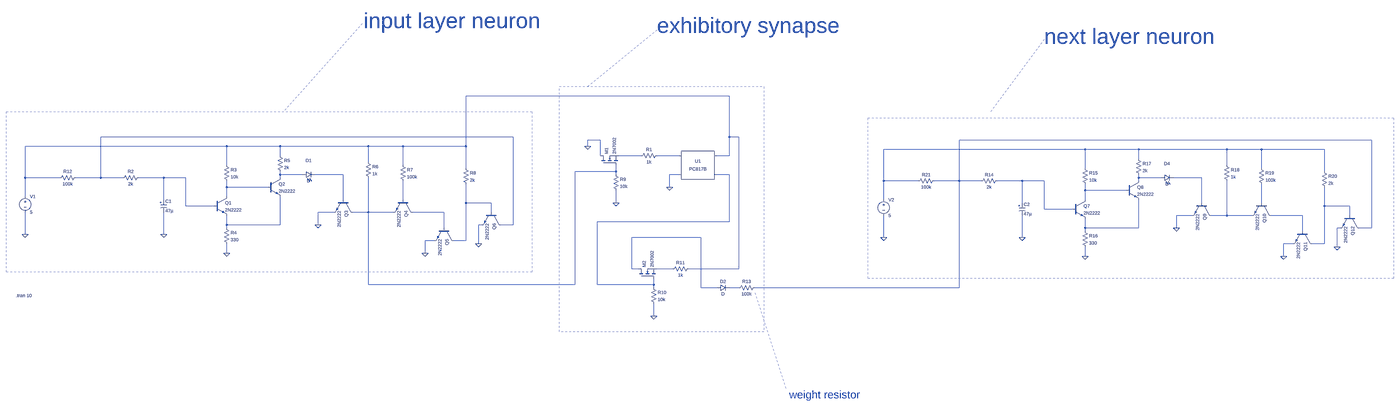
[diagram p0: schematic good_synapse_exhibitory.asc, whole sheet]
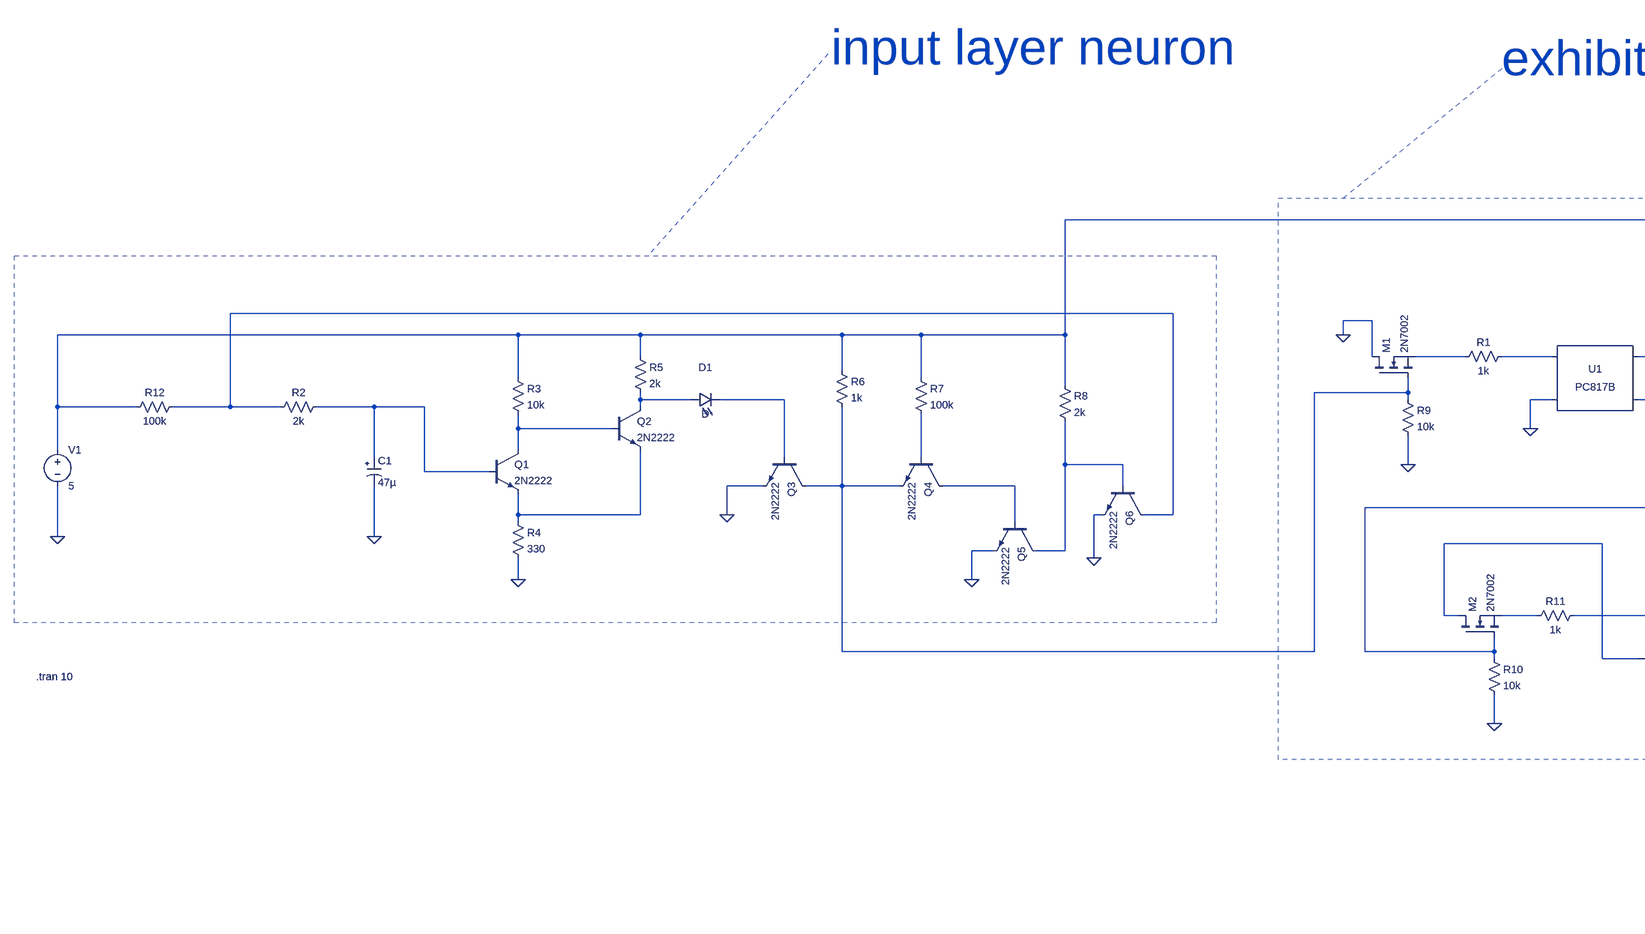
[diagram p1: schematic good_synapse_exhibitory.asc, part, row 1 of 1, column 1 of 2]
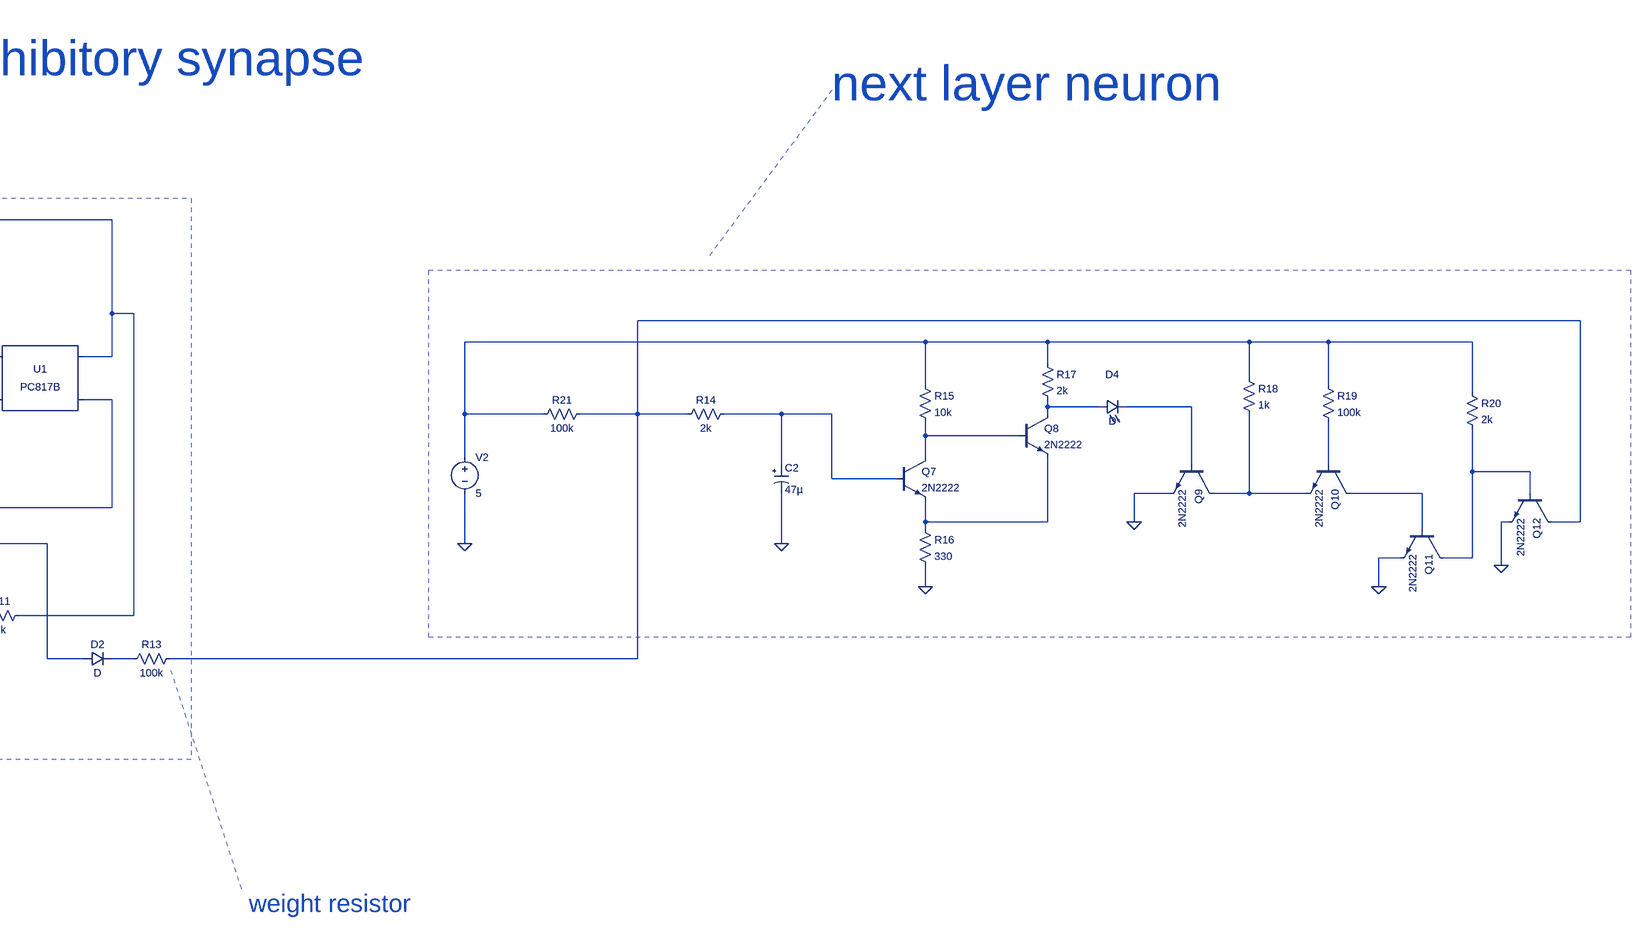
[diagram p2: schematic good_synapse_exhibitory.asc, part, row 1 of 1, column 2 of 2]
good_synapse_exhibitory.asc, the LTspice schematic file:
Version 4.1
SHEET 1 11668 9364
WIRE 3504 -400 2064 -400
WIRE 2304 -192 208 -192
WIRE 3504 -192 3504 -400
WIRE 3552 -192 3504 -192
WIRE 2848 -176 2784 -176
WIRE 6768 -176 4672 -176
WIRE 848 -144 -176 -144
WIRE 1120 -144 848 -144
WIRE 1568 -144 1120 -144
WIRE 1744 -144 1568 -144
WIRE 2064 -144 2064 -400
WIRE 2064 -144 1744 -144
WIRE 2784 -144 2784 -176
WIRE 5312 -128 4288 -128
WIRE 5584 -128 5312 -128
WIRE 6032 -128 5584 -128
WIRE 6208 -128 6032 -128
WIRE 6528 -128 6208 -128
WIRE 1120 -96 1120 -144
WIRE 2848 -96 2848 -176
WIRE 3056 -96 2944 -96
WIRE 3248 -96 3136 -96
WIRE 3504 -96 3504 -192
WIRE 3504 -96 3440 -96
WIRE 5584 -80 5584 -128
WIRE 1568 -64 1568 -144
WIRE 848 -48 848 -144
WIRE 1744 -48 1744 -144
WIRE 6032 -48 6032 -128
WIRE 2064 -32 2064 -144
WIRE 5312 -32 5312 -128
WIRE 6208 -32 6208 -128
WIRE 2928 -16 2928 -48
WIRE 2928 -16 2720 -16
WIRE 6528 -16 6528 -128
WIRE 1120 0 1120 -16
WIRE 1232 0 1120 0
WIRE 1440 0 1296 0
WIRE 2928 0 2928 -16
WIRE 3248 0 3200 0
WIRE 3504 0 3440 0
WIRE -176 16 -176 -144
WIRE 0 16 -176 16
WIRE 208 16 208 -192
WIRE 208 16 80 16
WIRE 320 16 208 16
WIRE 528 16 400 16
WIRE 640 16 528 16
WIRE 1120 16 1120 0
WIRE 5584 16 5584 0
WIRE 5696 16 5584 16
WIRE 5904 16 5760 16
WIRE 4288 32 4288 -128
WIRE 4464 32 4288 32
WIRE 4672 32 4672 -176
WIRE 4672 32 4544 32
WIRE 4784 32 4672 32
WIRE 4992 32 4864 32
WIRE 5104 32 4992 32
WIRE 5584 32 5584 16
WIRE 848 64 848 32
WIRE 1056 64 848 64
WIRE 3200 64 3200 0
WIRE 5312 80 5312 48
WIRE 5520 80 5312 80
WIRE -176 112 -176 16
WIRE 848 112 848 64
WIRE 528 128 528 16
WIRE 1440 128 1440 0
WIRE 1744 128 1744 32
WIRE 4288 128 4288 32
WIRE 5312 128 5312 80
WIRE 2064 144 2064 48
WIRE 2192 144 2064 144
WIRE 2928 144 2928 80
WIRE 4992 144 4992 32
WIRE 5904 144 5904 16
WIRE 6208 144 6208 48
WIRE 640 160 640 16
WIRE 784 160 640 160
WIRE 6528 160 6528 64
WIRE 6656 160 6528 160
WIRE 5104 176 5104 32
WIRE 5248 176 5104 176
WIRE 1392 192 1312 192
WIRE 1568 192 1568 16
WIRE 1568 192 1488 192
WIRE 1696 192 1568 192
WIRE 1952 192 1792 192
WIRE 2192 192 2192 144
WIRE 5856 208 5776 208
WIRE 6032 208 6032 32
WIRE 6032 208 5952 208
WIRE 6160 208 6032 208
WIRE 6416 208 6256 208
WIRE 6656 208 6656 160
WIRE 3504 240 3504 0
WIRE 3504 240 2832 240
WIRE 848 256 848 208
WIRE 1120 256 1120 112
WIRE 1120 256 848 256
WIRE 1312 256 1312 192
WIRE 2144 256 2128 256
WIRE 2304 256 2304 -192
WIRE 2304 256 2240 256
WIRE 848 272 848 256
WIRE 1952 272 1952 192
WIRE 5312 272 5312 224
WIRE 5584 272 5584 128
WIRE 5584 272 5312 272
WIRE 5776 272 5776 208
WIRE 6608 272 6592 272
WIRE 6768 272 6768 -176
WIRE 6768 272 6704 272
WIRE 5312 288 5312 272
WIRE 6416 288 6416 208
WIRE -176 304 -176 192
WIRE 528 304 528 192
WIRE 3360 320 3008 320
WIRE 4288 320 4288 208
WIRE 4992 320 4992 208
WIRE 1904 336 1856 336
WIRE 2064 336 2064 144
WIRE 2064 336 2000 336
WIRE 2128 352 2128 256
WIRE 6368 352 6320 352
WIRE 6528 352 6528 160
WIRE 6528 352 6464 352
WIRE 6592 368 6592 272
WIRE 848 400 848 352
WIRE 1856 400 1856 336
WIRE 5312 416 5312 368
WIRE 6320 416 6320 352
WIRE 3008 480 3008 320
WIRE 3040 480 3008 480
WIRE 3216 480 3136 480
WIRE 3552 480 3552 -192
WIRE 3552 480 3296 480
WIRE 1568 560 1568 192
WIRE 2720 560 2720 -16
WIRE 2720 560 1568 560
WIRE 2832 560 2832 240
WIRE 3120 560 3120 528
WIRE 3120 560 2832 560
WIRE 3120 576 3120 560
WIRE 3360 576 3360 320
WIRE 3440 576 3360 576
WIRE 3552 576 3504 576
WIRE 4672 576 4672 32
WIRE 4672 576 3632 576
WIRE 3120 720 3120 656
FLAG -176 304 0
FLAG 528 304 0
FLAG 848 400 0
FLAG 1312 256 0
FLAG 1856 400 0
FLAG 2128 352 0
FLAG 2784 -144 0
FLAG 2928 144 0
FLAG 3200 64 0
FLAG 3120 720 0
FLAG 4288 320 0
FLAG 4992 320 0
FLAG 5312 416 0
FLAG 5776 272 0
FLAG 6320 416 0
FLAG 6592 368 0
SYMBOL res 416 0 R90
WINDOW 0 0 56 VBottom 2
WINDOW 3 32 56 VTop 2
SYMATTR InstName R2
SYMATTR Value 2k
SYMBOL polcap 512 128 R0
SYMATTR InstName C1
SYMATTR Value 47µ
SYMBOL npn 784 112 R0
SYMATTR InstName Q1
SYMATTR Value 2N2222
SYMBOL res 832 -64 R0
SYMATTR InstName R3
SYMATTR Value 10k
SYMBOL res 832 256 R0
SYMATTR InstName R4
SYMATTR Value 330
SYMBOL npn 1056 16 R0
SYMATTR InstName Q2
SYMATTR Value 2N2222
SYMBOL res 1104 -112 R0
SYMATTR InstName R5
SYMATTR Value 2k
SYMBOL LED 1232 16 R270
WINDOW 0 72 32 VTop 2
WINDOW 3 0 32 VBottom 2
SYMATTR InstName D1
SYMBOL npn 1488 128 R90
SYMATTR InstName Q3
SYMATTR Value 2N2222
SYMBOL res 1552 -80 R0
SYMATTR InstName R6
SYMATTR Value 1k
SYMBOL npn 1792 128 R90
SYMATTR InstName Q4
SYMATTR Value 2N2222
SYMBOL res 1728 -64 R0
SYMATTR InstName R7
SYMATTR Value 100k
SYMBOL npn 2000 272 R90
SYMATTR InstName Q5
SYMATTR Value 2N2222
SYMBOL res 2048 -48 R0
SYMATTR InstName R8
SYMATTR Value 2k
SYMBOL npn 2240 192 R90
SYMATTR InstName Q6
SYMATTR Value 2N2222
SYMBOL res 96 0 R90
WINDOW 0 0 56 VBottom 2
WINDOW 3 32 56 VTop 2
SYMATTR InstName R12
SYMATTR Value 100k
SYMBOL voltage -176 96 R0
WINDOW 123 0 0 Left 0
WINDOW 39 0 0 Left 0
SYMATTR InstName V1
SYMATTR Value 5
SYMBOL nmos 2848 -48 R270
SYMATTR InstName M1
SYMATTR Value 2N7002
SYMBOL res 2912 -16 R0
SYMATTR InstName R9
SYMATTR Value 10k
SYMBOL Optos\\PC817B 3344 -48 R0
SYMATTR InstName U1
SYMBOL res 3152 -112 R90
WINDOW 0 0 56 VBottom 2
WINDOW 3 32 56 VTop 2
SYMATTR InstName R1
SYMATTR Value 1k
SYMBOL nmos 3040 528 R270
SYMATTR InstName M2
SYMATTR Value 2N7002
SYMBOL res 3104 560 R0
SYMATTR InstName R10
SYMATTR Value 10k
SYMBOL res 3312 464 R90
WINDOW 0 0 56 VBottom 2
WINDOW 3 32 56 VTop 2
SYMATTR InstName R11
SYMATTR Value 1k
SYMBOL diode 3440 592 R270
WINDOW 0 32 32 VTop 2
WINDOW 3 0 32 VBottom 2
SYMATTR InstName D2
SYMBOL res 3648 560 R90
WINDOW 0 0 56 VBottom 2
WINDOW 3 32 56 VTop 2
SYMATTR InstName R13
SYMATTR Value 100k
SYMBOL res 4880 16 R90
WINDOW 0 0 56 VBottom 2
WINDOW 3 32 56 VTop 2
SYMATTR InstName R14
SYMATTR Value 2k
SYMBOL polcap 4976 144 R0
SYMATTR InstName C2
SYMATTR Value 47µ
SYMBOL npn 5248 128 R0
SYMATTR InstName Q7
SYMATTR Value 2N2222
SYMBOL res 5296 -48 R0
SYMATTR InstName R15
SYMATTR Value 10k
SYMBOL res 5296 272 R0
SYMATTR InstName R16
SYMATTR Value 330
SYMBOL npn 5520 32 R0
SYMATTR InstName Q8
SYMATTR Value 2N2222
SYMBOL res 5568 -96 R0
SYMATTR InstName R17
SYMATTR Value 2k
SYMBOL LED 5696 32 R270
WINDOW 0 72 32 VTop 2
WINDOW 3 0 32 VBottom 2
SYMATTR InstName D4
SYMBOL npn 5952 144 R90
SYMATTR InstName Q9
SYMATTR Value 2N2222
SYMBOL res 6016 -64 R0
SYMATTR InstName R18
SYMATTR Value 1k
SYMBOL npn 6256 144 R90
SYMATTR InstName Q10
SYMATTR Value 2N2222
SYMBOL res 6192 -48 R0
SYMATTR InstName R19
SYMATTR Value 100k
SYMBOL npn 6464 288 R90
SYMATTR InstName Q11
SYMATTR Value 2N2222
SYMBOL res 6512 -32 R0
SYMATTR InstName R20
SYMATTR Value 2k
SYMBOL npn 6704 208 R90
SYMATTR InstName Q12
SYMATTR Value 2N2222
SYMBOL res 4560 16 R90
WINDOW 0 0 56 VBottom 2
WINDOW 3 32 56 VTop 2
SYMATTR InstName R21
SYMATTR Value 100k
SYMBOL voltage 4288 112 R0
WINDOW 123 0 0 Left 0
WINDOW 39 0 0 Left 0
SYMATTR InstName V2
SYMATTR Value 5
TEXT -224 616 Left 2 !.tran 10
TEXT 1544 -784 Left 7 ;input layer neuron
TEXT 3136 -760 Left 7 ;exhibitory synapse
TEXT 5104 -704 Left 7 ;next layer neuron
TEXT 3808 1120 Left 5 ;weight resistor
LINE Normal 1536 -768 1136 -320 2
LINE Normal 3136 -736 2784 -448 2
LINE Normal 5104 -688 4832 -320 2
LINE Normal 3792 1088 3632 592 2
RECTANGLE Normal 2400 496 -272 -320 2
RECTANGLE Normal 3680 800 2640 -448 2
RECTANGLE Normal 6880 528 4208 -288 2

The netlist it stands for:
* good_synapse_exhibitory.asc
R2 N011 N002 2k
C1 N011 0 47µ
Q1 N015 N011 N024 0 2N2222
R3 N001 N015 10k
R4 N024 0 330
Q2 N008 N015 N024 0 2N2222
R5 N001 N008 2k
D1 N008 N009 D
Q3 N007 N009 0 0 2N2222
R6 N001 N007 1k
Q4 N021 N017 N007 0 2N2222
R7 N001 N017 100k
Q5 N018 N021 0 0 2N2222
R8 N001 N018 2k
Q6 N002 N018 0 0 2N2222
R12 N002 N001 100k
V1 N001 0 5
M1 0 N007 N005 N005 2N7002
R9 N007 0 10k
X§U1 N006 0 N001 N010 PC817 Igain=1.5m
R1 N006 N005 1k
M2 N026 N010 N027 N027 2N7002
R10 N010 0 10k
R11 N001 N027 1k
D2 N026 N028 D
R13 N003 N028 100k
R14 N014 N003 2k
C2 N014 0 47µ
Q7 N016 N014 N025 0 2N2222
R15 N004 N016 10k
R16 N025 0 330
Q8 N012 N016 N025 0 2N2222
R17 N004 N012 2k
D4 N012 N013 D
Q9 N022 N013 0 0 2N2222
R18 N004 N022 1k
Q10 N023 N019 N022 0 2N2222
R19 N004 N019 100k
Q11 N020 N023 0 0 2N2222
R20 N004 N020 2k
Q12 N003 N020 0 0 2N2222
R21 N003 N004 100k
V2 N004 0 5
.model D D
.lib standard.dio
.model NPN NPN
.model PNP PNP
.lib standard.bjt
.model NMOS NMOS
.model PMOS PMOS
.lib standard.mos
.tran 10
* input layer neuron
* exhibitory synapse
* next layer neuron
* weight resistor
.lib PC817.sub
.backanno
.end